# EAGLE design dip8_a5 (EAGLE 5.11)
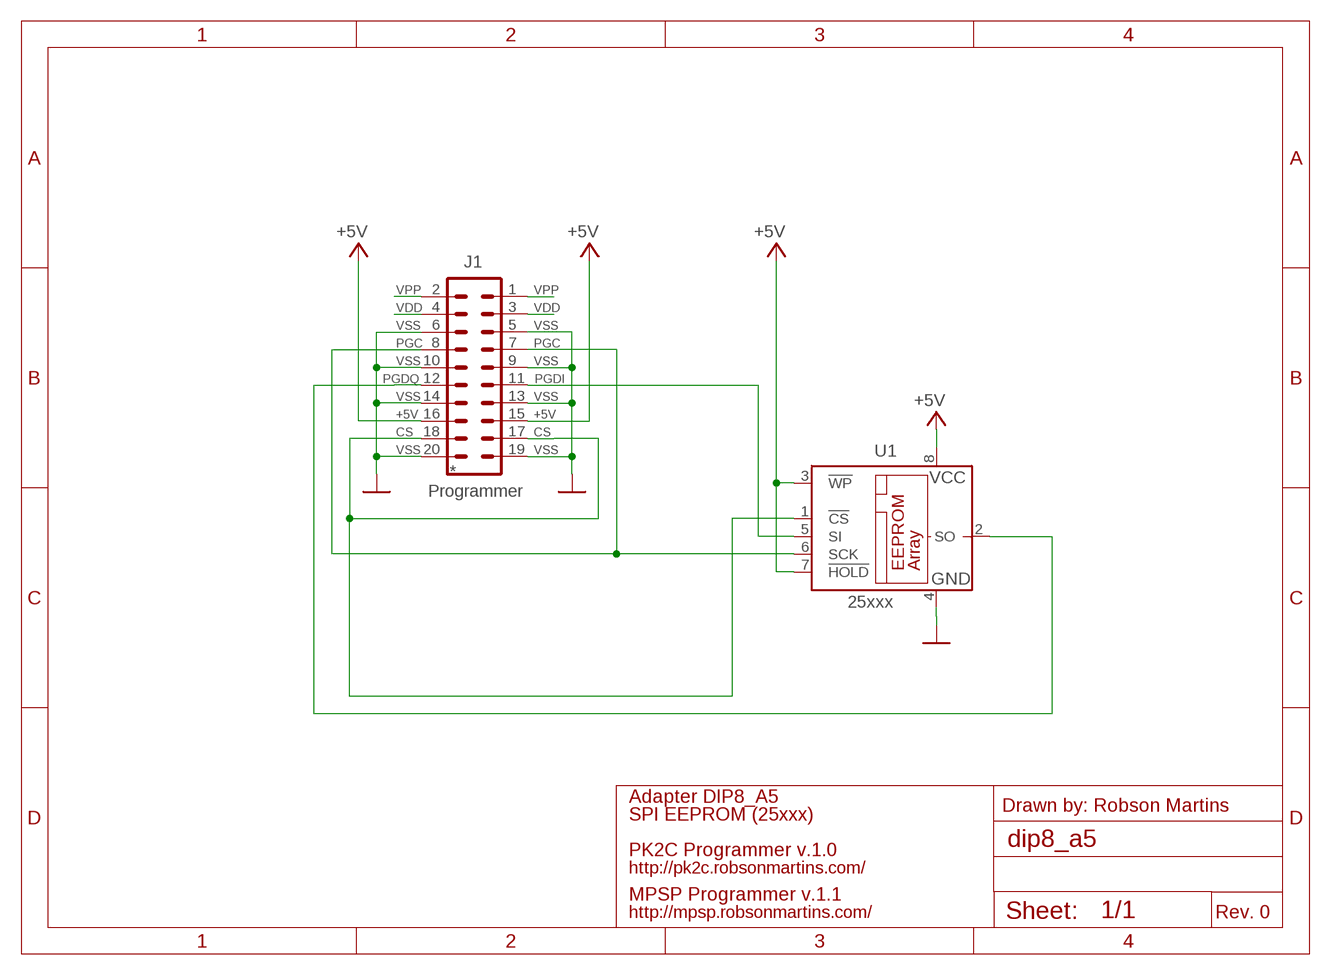
[diagram p0: schematic, sheet 1]

## Parts
J1  Programmer  MA10-2  [MA10-2]
U1  25xxx  25LC040P  [DIL8]

## Nets
+5V: J1.15 J1.16 U1.3(!WP) U1.7(!HOLD) U1.8(VCC)
CS: J1.17 J1.18 U1.1(!CS)
GND: J1.5 J1.6 J1.9 J1.10 J1.13 J1.14 J1.19 J1.20 U1.4(GND)
PGC: J1.7 J1.8 U1.6(SCK)
PGDI: J1.11 U1.5(SI)
PGDQ: J1.12 U1.2(SO)
VDD: J1.3 J1.4
VPP: J1.1 J1.2

## Notes on the sheet
- VPP | VPP
- VDD | VDD
- VSS | VSS
- PGC | PGC
- VSS | VSS
- PGDQ | PGDI
- VSS | VSS
- +5V | +5V
- CS | CS
- VSS | VSS
- *
- Adapter DIP8_A5
- Drawn by: Robson Martins
- SPI EEPROM (25xxx)
- PK2C Programmer v.1.0
- http://pk2c.robsonmartins.com/
- MPSP Programmer v.1.1
- http://mpsp.robsonmartins.com/ | Rev. 0

## Library data of the parts
J1 = con-lstb:MA10-2: PIN HEADER; OC_FARNELL: unknown; OC_NEWARK: unknown
U1 = microchip:25*: Serial EEPROM 4K/ 8K , SPI bus; MF: MICROCHIP; MPN: 25LC040/P; OC_FARNELL: 9758100; OC_NEWARK: 96K4091

## Board
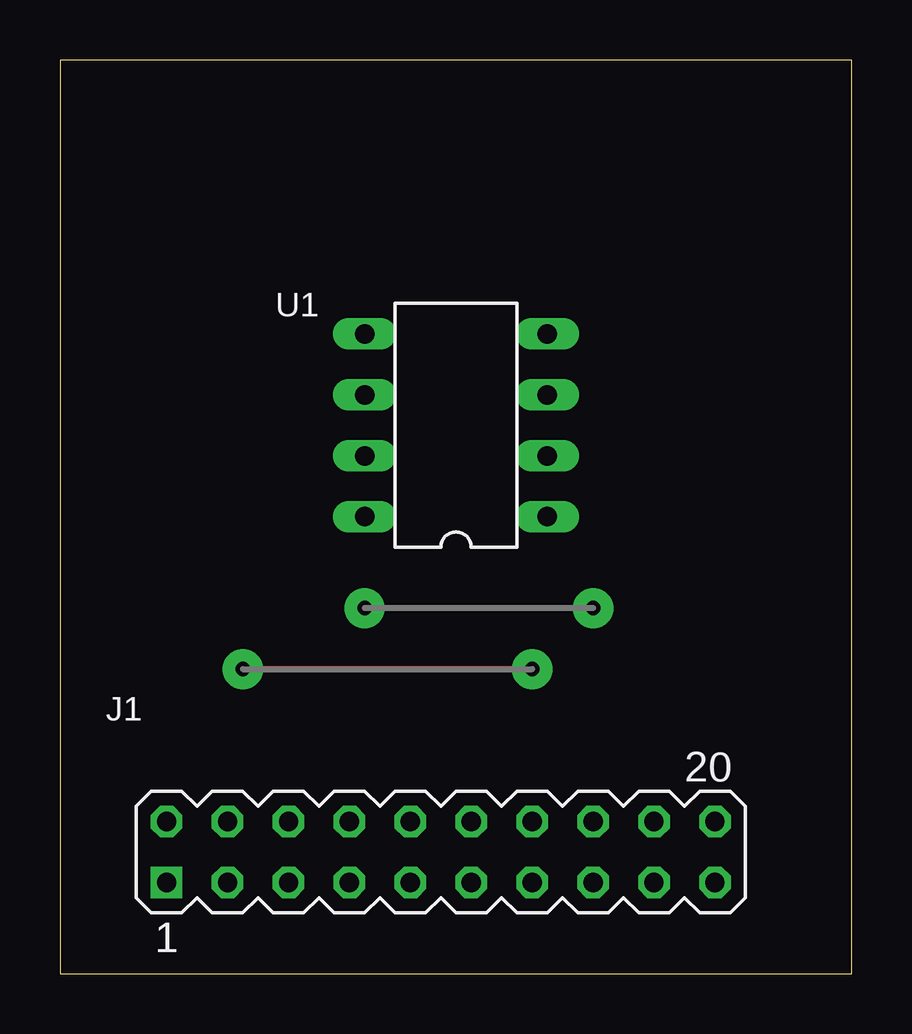
[diagram p1: board, top side]
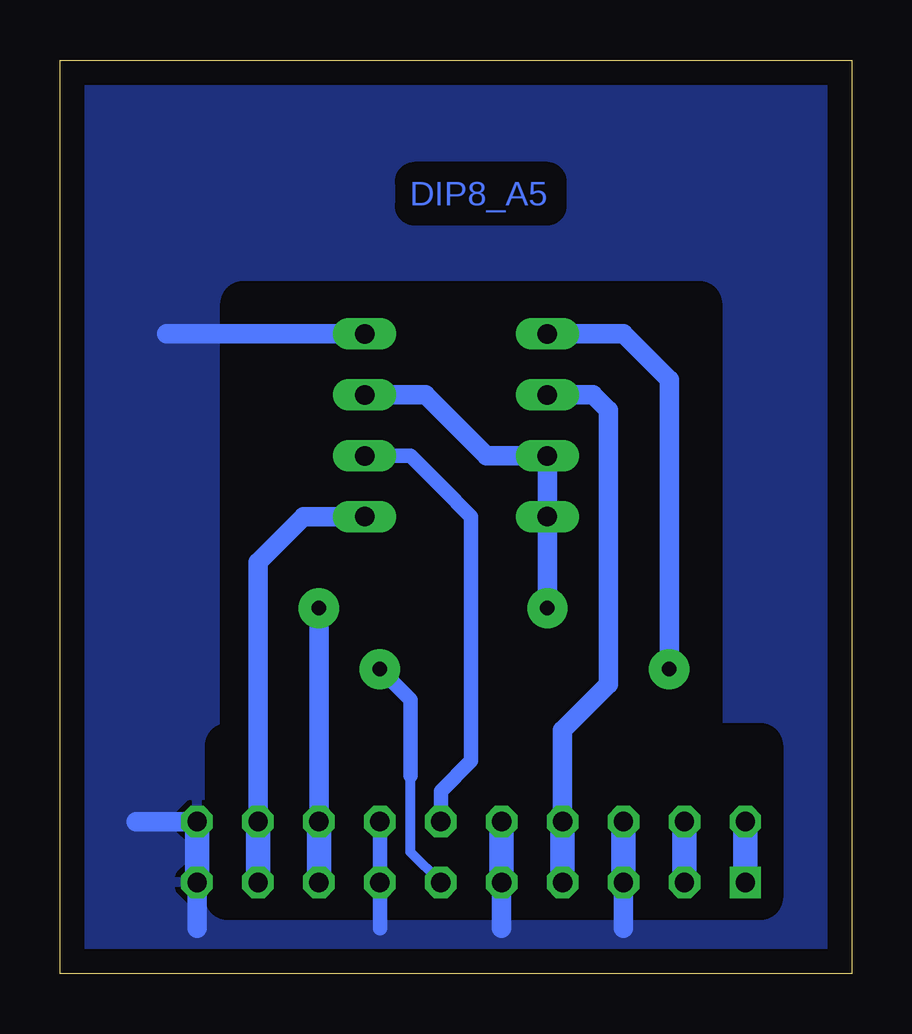
[diagram p2: board, bottom side, seen from below]

Size 33.02 x 38.08 mm. Coordinates in mm from the lower left corner, seen from the top.
Outline: 33.02,0 33.02,38.08 0,38.08 0,0 33.02,0
Copper layers (1*16): Top 0.035mm / dielectric 1.5mm / Bottom 0.035mm
Design rules "default": minimum track width 10mil, minimum drill 24mil, track to track 8mil, track to pad 8mil, pad to pad 8mil, via to via 8mil, smd to smd 8mil, copper to edge 40mil, drill to drill 8mil, minimum pad ring 10mil, minimum via ring 8mil, stop-mask expansion 4mil, vias tented up to drill 0mil, thermal gap 10mil
bRestrict: area 3.8,3.2 to 26,9.5; area 6.4,9.5 to 25.4,27.9

### Footprints (pad centres in the part's own frame; a part is rotated, then mirrored left to right if it is on the bottom)
MA10-2 = drill 0.8 pad 1.27 square: 1 -11.43,-1.27 | drill 0.8 pad 1.27 octagon: 2 -11.43,1.27; 3 -8.89,-1.27; 4 -8.89,1.27; 5 -6.35,-1.27; 6 -6.35,1.27; 7 -3.81,-1.27; 8 -3.81,1.27; 9 -1.27,-1.27; 10 -1.27,1.27; 11 1.27,-1.27; 12 1.27,1.27; 13 3.81,-1.27; 14 3.81,1.27; 15 6.35,-1.27; 16 6.35,1.27; 17 8.89,-1.27; 18 8.89,1.27; 19 11.43,-1.27; 20 11.43,1.27
DIL8 = drill 0.813 long: 1 -3.81,-3.81; 2 -1.27,-3.81; 3 1.27,-3.81; 4 3.81,-3.81; 5 3.81,3.81; 6 1.27,3.81; 7 -1.27,3.81; 8 -3.81,3.81

### Placement (x,y rotation side)
J1  15.88,5.08 0 top
U1  16.51,22.86 90 top

### Tracks (layer width: path | path; a pad name or v marks a point on that pad's centre or on a via)
+5V  (via drill 0.6 pad 1.68)
  Top 0.254: v22.23,15.24 v12.7,15.24
  Bottom 0.813: J1.16 22.23,8.89 v22.23,15.24 | U1.3 17.78,24.13 15.24,21.59 U1.7 U1.8 v12.7,15.24
  Bottom 1.016: J1.15 J1.16
CS
  Bottom 0.813: J1.18 24.77,17.14 22.86,19.05 U1.1
  Bottom 1.016: J1.17 J1.18
GND
  Bottom 0.61: J1.13 19.69,1.91 J1.14
  Bottom 0.813: 9.53,1.91 J1.6 | 14.61,1.91 J1.9 | 27.31,1.91 J1.19 | J1.20 29.85,6.35 | U1.4 28.58,26.67
  Bottom 1.016: J1.6 J1.5 | J1.9 J1.10 | J1.19 J1.20
  pour Bottom (isolate 0.813): 33.02,0 0,0 0,38.1 33.02,38.1
PGC
  Bottom 0.813: J1.8 12.07,7.62 12.07,10.16 10.16,12.06 10.16,14.61 10.16,23.5 10.8,24.13 U1.6
  Bottom 1.016: J1.7 J1.8
PGDI  (via drill 0.6 pad 1.68)
  Top 0.254: v19.69,12.7 v7.62,12.7
  Bottom 0.406: 18.42,8.89 18.42,8.26 18.42,5.08 J1.11
  Bottom 0.61: 18.42,8.26 18.42,10.16 18.42,10.79 18.42,11.43 v19.69,12.7
  Bottom 0.813: U1.5 9.53,26.67 7.62,24.77 v7.62,12.7
PGDQ
  Bottom 0.61: U1.2 18.42,21.59 17.15,20.32 15.88,19.05 15.88,8.89 17.15,7.62 J1.12
VDD
  Bottom 1.016: J1.3 J1.4
VPP
  Bottom 1.016: J1.1 J1.2

### Text on the board
Bottom: DIP8_A5
tDocu: SPI EEPROM | DIP8_A5 | 25xxx | Adapter | VSS | VPP | VDD | VSS | PGC | VSS | PGDI/Q | VSS | +5V | CS